# Altium schematic sheet Constant Current Load.SchDoc
size A4
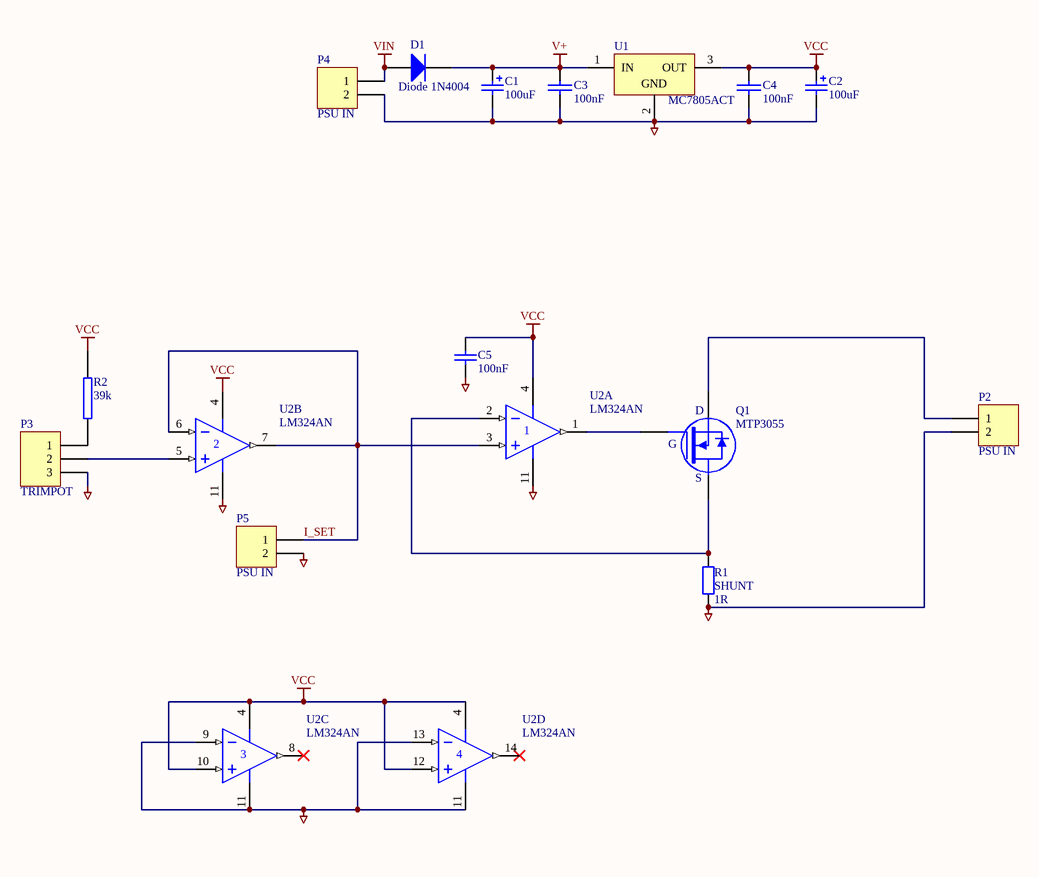
[diagram p0: Constant Current Load.SchDoc]

## Parts
C1  100uF  [RB5-10.5]
C2  100uF  [RB5-10.5]
C3  100nF  [CAP (3D) - 0603]
C4  100nF  [CAP (3D) - 0603]
C5  100nF  [CAP (3D) - 0603]
D1  Diode 1N4004  [DO-41]
P2  PSU IN  [5.08mm HEADER 2 Way RA- With Socket]
P3  TRIMPOT  [PCB POT]
P4  PSU IN  [2 x 3.81mm RA]
P5  PSU IN  [HDR1X2]
Q1  MTP3055  [TO-220AB]
R1  SHUNT  value 1R  [5W WW]
R2  39k  [RES (3D) - 0603]
U1  MC7805ACT  [TO-220AB]
U2  LM324AN  [DIP-14]  (parts A,B,C,D of 4)

## Nets
GND: C1.2 C2.2 C3.2 C4.2 C5.1 P2.2 P3.3 P4.2 P5.2 R1.1 U1.2(GND) U2.9(IN-) U2.11(V-) U2.13(IN-)
V+: C1.1 C3.1 D1.2(K) U1.1(IN)
VCC: C2.1 C4.1 C5.2 R2.2 U1.3(OUT) U2.4(V+) U2.10(IN+) U2.12(IN+)
VIN: D1.1(A) P4.1
I_SET: P5.1 U2.3(IN+) U2.6(IN-) U2.7(OUT)
NetP2_1: P2.1 Q1.2(D)
NetP3_1: P3.1 R2.1
NetP3_2: P3.2 U2.5(IN+)
NetQ1_1: Q1.1(G) U2.1(OUT)
NetQ1_3: Q1.3(S) R1.2 U2.2(IN-)

Not connected (* = marked no-connect by the designer): U2 8(OUT)* 14(OUT)*

## Library data of the parts
C1 C2 = Cap Pol: CAPACITOR POLARISED TAG B CASE; Manufacturer: Generic Components; Manufacturer Part No.: 293D106X9020B8T; value: 100uF; Mouser Part no.: 74-293D106X9020B8T; Web link: http://au.mouser.com/ProductDetail/Vishay-Sprague/293D106X9020B8T/?qs=sGAEpiMZZMukHu%252bjC5l7YZW4AlqROhXN47lkpjjQgHw%3d
C3 C4 = CAP: CAPACITOR SMD 0603; Manufacturer: Murata; Manufacturer Part No.: GCM188R71C104KA37D; value: 100nF; Mouser Part no.: 81-GCM188R71C104KA7D; Web link: http://au.mouser.com/ProductDetail/Murata/GCM188R71C104KA37D/?qs=aEuGZpxfbxWKAxwYn%252beTMg%3d%3d
C5 = Cap: Capacitor; Manufacturer: YAEGO; Manufacturer Part No.: CC0603ZRY5V9BB104; Value: 100nF; Mouser Part no.: 603-C0603ZRY5V9BB104; Web link: http://au.mouser.com/ProductDetail/Yageo/CC0603ZRY5V9BB104/?qs=AgBp2OyFlx%252bk1xe0tOfw5lSGBXIDidlPHbEeepmuVSw%3d; Supplier 1: Mouser; Supplier 2: Digi-Key; Supplier Part Number 1: 603-C0603ZRY5V9BB104; Supplier Part Number 2: 311-1343-2-ND
D1 = Diode 1N4004: 1 Amp General Purpose Rectifier; Published: 8-Jun-2000; LatestRevisionDate: 17-Jul-2002; LatestRevisionNote: Re-released for DXP Platform.; DatasheetVersion: 1998; PackageVersion: Aug-1999; PackageReference: DO-41; Publisher: Altium Limited; PackageDescription: Diode, Axial; Body 5.2 x 2.7 mm (LxDia. max), Lead Dia. 0.86 mm (max); Code_JEDEC: DO-204-AL; ComponentLink1Description: Manufacturer Link; ComponentLink1URL: http://www.fairchildsemi.com/; ComponentLink2Description: Datasheet; ComponentLink2URL: http://www.fairchildsemi.com/ds/1N%2F1N4001.pdf
P2 P4 P5 = Header 2: Header, 2-Pin; LatestRevisionDate: 17-Jul-2002; LatestRevisionNote: Re-released for DXP Platform.; Publisher: Altium Limited
P3 = Header 3: Header, 3-Pin; LatestRevisionDate: 17-Jul-2002; LatestRevisionNote: Re-released for DXP Platform.; Publisher: Altium Limited
Q1 = MTP3055: MTP3055 P-Channel MOSFET; Value: MTP3055
R1 = Res2: Resistor; Published: 8-Jun-2000; LatestRevisionDate: 17-Jul-2002; LatestRevisionNote: Re-released for DXP Platform.; PackageReference: AXIAL-0.4; Publisher: Altium Limited; PackageDescription: Axial Device, Thru-Hole; 2 Leads; 0.4 in Pin Spacing
R2 = RES SMD 0603 10k: RESISTOR SMD 0603; Manufacturer: Bourns; Manufacturer Part No.: CR0603-JW-102ELF; Mouser Part no.: 652-CR0603-JW-102ELF; Farnell Part no.: 9331700; Web link: http://au.mouser.com/ProductDetail/Bourns/CR0603-JW-102ELF/?qs=sGAEpiMZZMu61qfTUdNhG2nPoCjtvs%252bRXTOJv8O9Kbk%3d; value: 39k
U1 = MC7805ACT: 3-Terminal Positive Fixed Voltage Regulator; Manufacturer: Fairchild Semiconductor; Value: LM7805ACT; Mouser Part No.: 512-LM7805ACT; Manufacturer Part No.: LM7805ACT; Web link: http://au.mouser.com/ProductDetail/Fairchild-Semiconductor/LM7805ACT/?qs=VOMQJJE%252bBNlQknJDd4ZVLg%3d%3d
U2 = LM324AN: Quadruple Operational Amplifier; Manufacturer: ST MICRO; Value: LM324; Manufacturer Part No.: LM324AN; Mouser Part No.: 511-LM324AN; Web Link: http://au.mouser.com/ProductDetail/STMicroelectronics/LM324AN/?qs=Aez0sHNrW%2fUytSAnJAKyV%252b8BIEGXhIFhom0MkRvP3bs%3d; Supplier 1: Mouser; Supplier Part Number 1: 595-LM324AN; Supplier 2: Digi-Key; Supplier Part Number 2: 497-1579-5-ND